# EAGLE design CCBee (EAGLE 5.11)
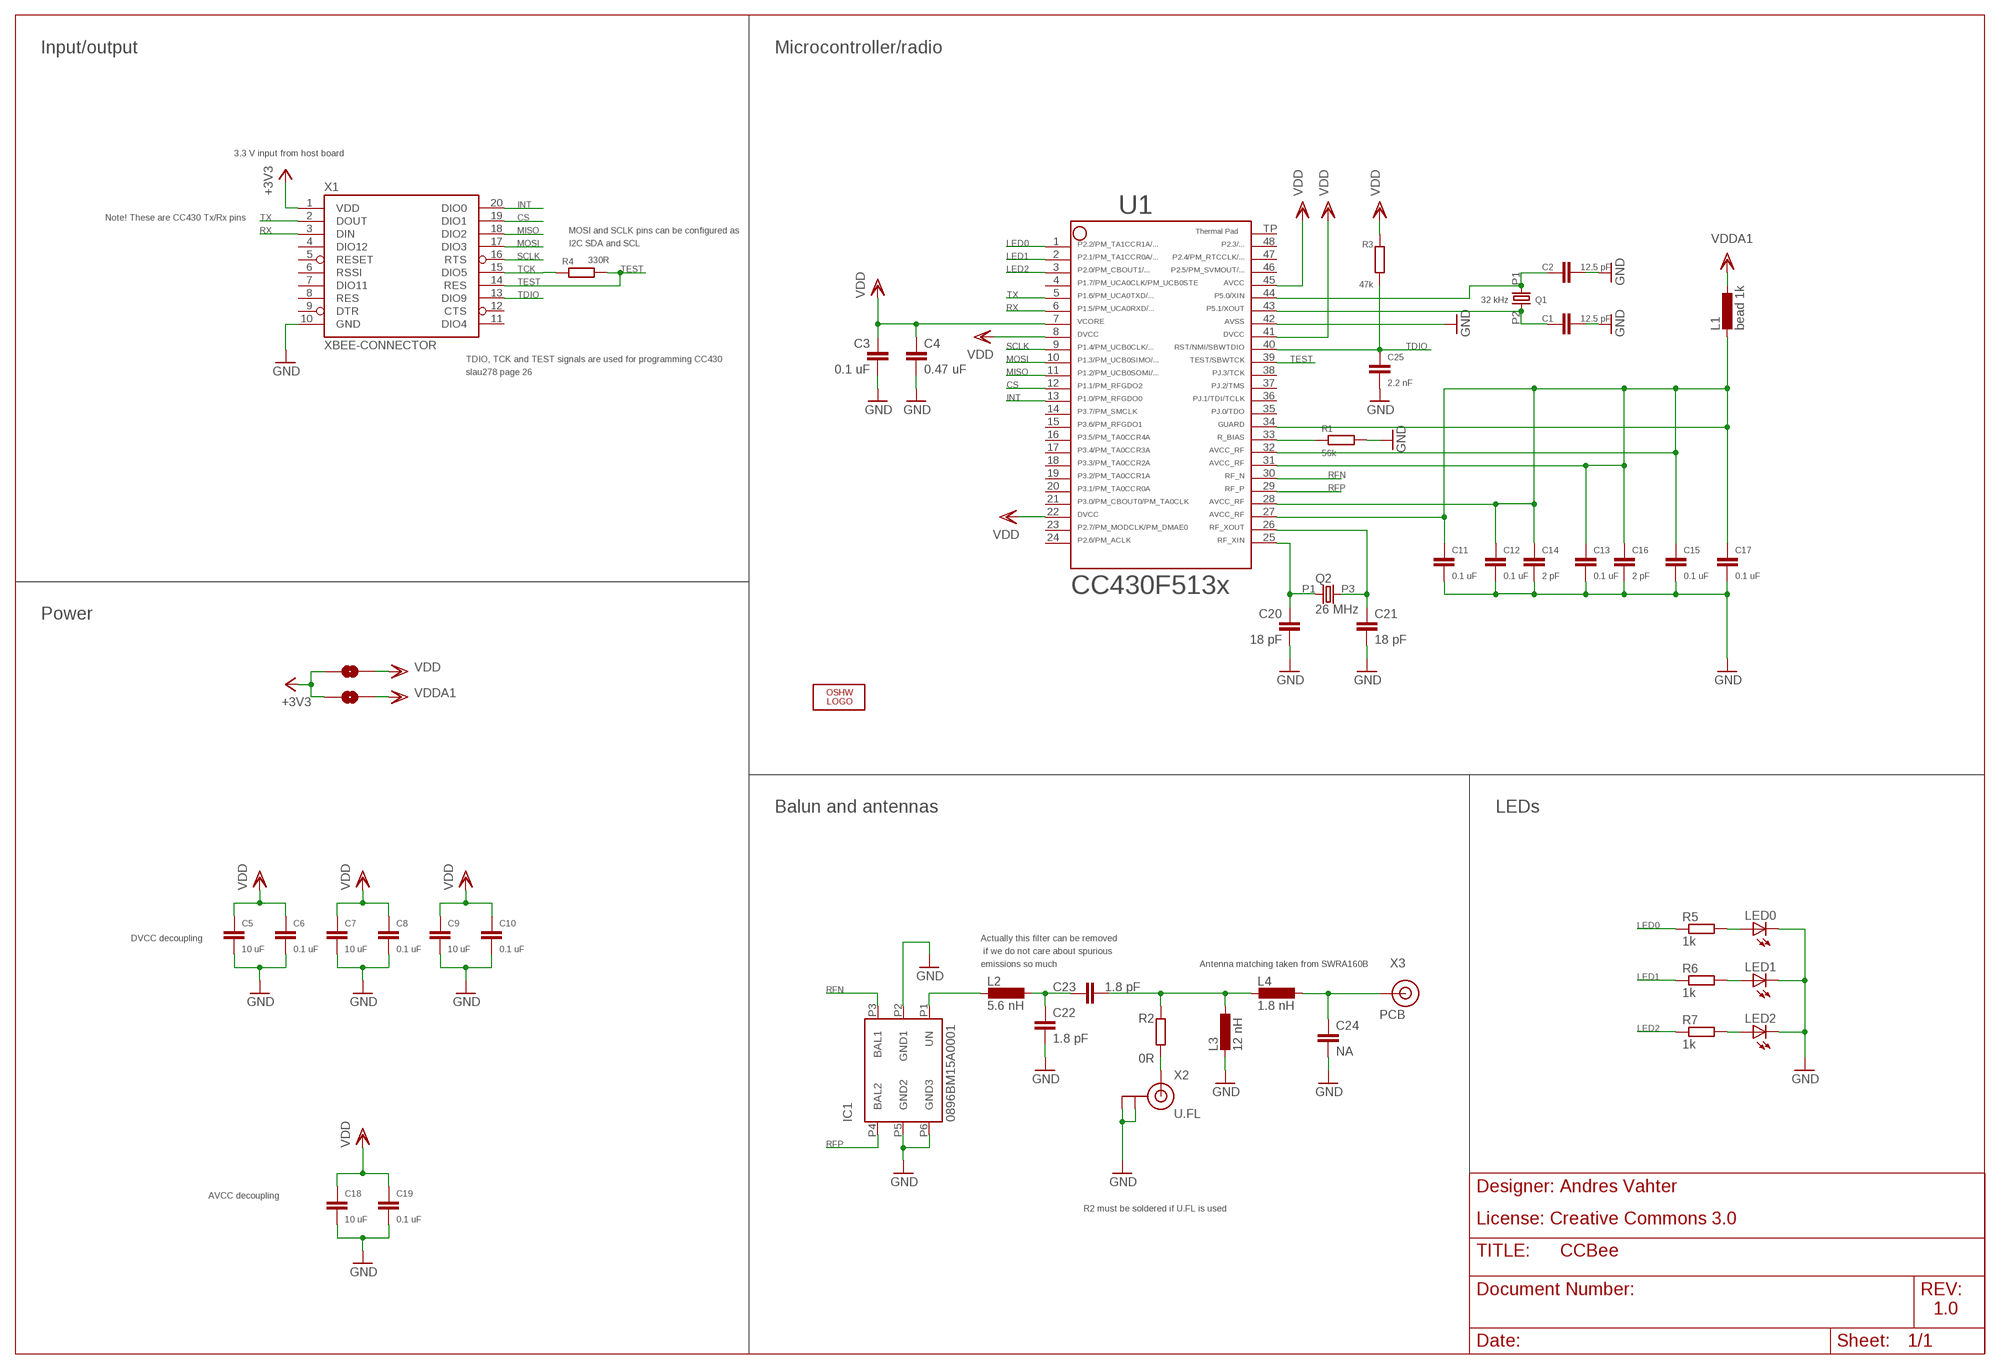
[diagram p0: schematic, sheet 1]

## Parts
C1  12.5 pF  C-EUC0402  [C0402]
C2  12.5 pF  C-EUC0402  [C0402]
C3  0.1 uF  C-EUC0402  [C0402]
C4  0.47 uF  C-EUC0603  [C0603]
C5  10 uF  C-EUC0603  [C0603]
C6  0.1 uF  C-EUC0402  [C0402]
C7  10 uF  C-EUC0603  [C0603]
C8  0.1 uF  C-EUC0402  [C0402]
C9  10 uF  C-EUC0603  [C0603]
C10  0.1 uF  C-EUC0402  [C0402]
C11  0.1 uF  C-EUC0402  [C0402]
C12  0.1 uF  C-EUC0402  [C0402]
C13  0.1 uF  C-EUC0402  [C0402]
C14  2 pF  C-EUC0402  [C0402]
C15  0.1 uF  C-EUC0402  [C0402]
C16  2 pF  C-EUC0402  [C0402]
C17  0.1 uF  C-EUC0402  [C0402]
C18  10 uF  C-EUC0603  [C0603]
C19  0.1 uF  C-EUC0402  [C0402]
C20  18 pF  C-EUC0402  [C0402]
C21  18 pF  C-EUC0402  [C0402]
C22  1.8 pF  C-EUC0402  [C0402]
C23  1.8 pF  C-EUC0402  [C0402]
C24  NA  C-EUC0402  [C0402]
C25  2.2 nF  C-EUC0603  [C0603]
IC1  0896BM15A0001  JOHANSON-BM  [JOHANSON-BM]
L1  bead 1k  L-EUL0603  [L0603]
L2  5.6 nH  L-EUL0402  [L0402]
L3  12 nH  L-EUL0402  [L0402]
L4  1.8 nH  L-EUL0402  [L0402]
LED0  LEDCHIP-LED0603  [CHIP-LED0603]
LED1  LEDCHIP-LED0603  [CHIP-LED0603]
LED2  LEDCHIP-LED0603  [CHIP-LED0603]
LOGO1  OSHW_LOGO_8MILX0200-NT  [OSHW_8X200_NOTEXT]
Q1  32 kHz  FC-13F  [FC-13F-3.2X1.5]
Q2  26 MHz  TXC  [TXC-5.0X3.2]
R1  56k  R-EU_R0402  [R0402]
R2  0R  R-EU_R0402  [R0402]
R3  47k  R-EU_R0402  [R0402]
R4  330R  R-EU_R0402  [R0402]
R5  1k  R-EU_R0402  [R0402]
R6  1k  R-EU_R0402  [R0402]
R7  1k  R-EU_R0402  [R0402]
SJ1  SOLDERJUMPERNC  [SJ_2S]
SJ2  SOLDERJUMPERNC  [SJ_2S]
U1  CC430F5137  CC430F513X---RGZ48  [RGZ48]
X1  XBEE-CONNECTOR  XBEE-1B1  [XBEE-1]
X2  U.FL  [U.FL]
X3  PCB  JOHANSON-0868AT43A0020  [JOHANSON-0868AT43A0020]

## Nets
+3V3: SJ1.1 SJ2.1 X1.1(VDD)
CS: U1.12 X1.19(DIO1)
GND: C1.2 C2.2 C3.2 C4.2 C5.2 C6.2 C7.2 C8.2 C9.2 C10.2 C11.2 C12.2 C13.2 C14.2 C15.2 C16.2 C17.2 C18.2 C19.2 C20.2 C21.2 C22.2 C24.2 C25.2 IC1.P2(GND1) IC1.P5(GND2) IC1.P6(GND3) L3.2 LED0.C LED1.C LED2.C R1.2 U1.42 X1.10(GND) X2.P$1(GND) X2.P$2(GND)
INT: U1.13 X1.20(DIO0)
LED0: R5.1 U1.1
LED1: R6.1 U1.2
LED2: R7.1 U1.3
MISO: U1.11 X1.18(DIO2)
MOSI: U1.10 X1.17(DIO3)
N$1: C1.1 Q1.P2 U1.43
N$2: C2.1 Q1.P1 U1.44
N$3: R1.1 U1.33
N$4: C22.1 C23.1 L2.1
N$5: C20.1 Q2.P1 U1.25
N$6: C21.1 Q2.P3 U1.26
N$7: C23.2 L3.1 L4.2 R2.2
N$8: R2.1 X2.P$3(SIGNAL)
N$9: IC1.P1(UN) L2.2
N$10: LED0.A R5.2
N$11: C24.1 L4.1 X3.P1
N$13: LED1.A R6.2
N$14: LED2.A R7.2
N$15: C11.1 C12.1 C13.1 C14.1 C15.1 C16.1 C17.1 L1.2 U1.27 U1.28 U1.31 U1.32 U1.34
RFN: IC1.P3(BAL1) U1.30
RFP: IC1.P4(BAL2) U1.29
RX: U1.6 X1.3(DIN)
SCLK: U1.9 X1.16(RTS)
TCK: R4.2 X1.15(DIO5)
TDIO: C25.1 R3.1 U1.40 X1.13(DIO9)
TEST: R4.1 U1.39 X1.14(RES)
TX: U1.5 X1.2(DOUT)
VDD: C3.1 C4.1 C5.1 C6.1 C7.1 C8.1 C9.1 C10.1 C18.1 C19.1 R3.2 SJ1.2 U1.7 U1.8 U1.22 U1.41 U1.45
VDDA1: L1.1 SJ2.2
Unconnected: Q2.P2(GND) Q2.P4(GND) U1.4 U1.14 U1.15 U1.16 U1.17 U1.18 U1.19 U1.20 U1.21 U1.23 U1.24 U1.35 U1.36 U1.37 U1.38 U1.46 U1.47 U1.48 X1.4(DIO12) X1.5(RESET) X1.6(RSSI) X1.7(DIO11) X1.8(RES) X1.9(DTR) X1.11(DIO4) X1.12(CTS) X3.NC1 X3.NC2 X3.NC3 X3.NC4 X3.NC5 X3.P2

## Notes on the sheet
- Input/output | Microcontroller/radio
- 3.3 V input from host board
- Note! These are CC430 Tx/Rx pins
- MOSI and SCLK pins can be configured as
- I2C SDA and SCL
- TDIO, TCK and TEST signals are used for programming CC430
- slau278 page 26
- Power
- Balun and antennas | LEDs
- DVCC decoupling | Actually this filter can be removed
- if we do not care about spurious
- emissions so much | Antenna matching taken from SWRA160B
- Designer: Andres Vahter
- AVCC decoupling
- R2 must be soldered if U.FL is used
- License: Creative Commons 3.0
- 1.0

## Power pins joined to a net without a drawn wire
49: U1.TP

## Library data of the parts
C1-C25 = rcl:C-EU: CAPACITOR, European symbol
IC1 = balun:JOHANSON-BM
L1-L4 = rcl:L-EU: INDUCTOR, European symbol
LED0 LED1 LED2 = led:LED: LED OSRAM: - CHIPLED LG R971, LG N971, LY N971, LG Q971, LY Q971, LO R971, LY R971 LH N974, LH R974 LS Q976, LO Q976, LY Q976 LO Q996 - Hyper CHIPLED LW Q18S LB Q993, LB Q99A, LB R99A - SideLED LS A670, LO A670, LY A670, LG A670, LP A670 LB A673, LV A673, LT A673, LW A673 LH A674 LY A675 LS A676, LA A676, LO A676, LY A676, LW A676 LS A679, LY A679, LG A679 - Hyper Micro SIDELED® LS Y876, LA Y876, LO Y876, LY Y876 LT Y87S - SmartLED LW L88C, LW L88S LB L89C, LB L89S, LG L890 LS L89K, LO L89K, LY L89K LS L896, LA L896, LO L896, LY L896 - TOPLED LS T670, LO T670, LY T670, LG T670, LP T670 LSG T670, LSP T670, LSY T670, LOP T670, LYG T670 LG T671, LOG T671, LSG T671 LB T673, LV T673, LT T673, LW T673 LH T674 LS T676, LA T676, LO T676, LY T676, LB T676, LH T676, LSB T676, LW T676 LB T67C, LV T67C, LT T67C, LS T67K, LO T67K, LY T67K, LW E67C LS E67B, LA E67B, LO E67B, LY E67B, LB E67C, LV E67C, LT E67C LW T67C LS T679, LY T679, LG T679 LS T770, LO T770, LY T770, LG T770, LP T770 LB T773, LV T773, LT T773, LW T773 LH T774 LS E675, LA E675, LY E675, LS T675 LS T776, LA T776, LO T776, LY T776, LB T776 LHGB T686 LT T68C, LB T68C - Hyper Mini TOPLED® LB M676 - Mini TOPLED Santana® LG M470 LS M47K, LO M47K, LY M47K Source: http://www.osram.convergy.de LUXEON: - LUMILED® LXK2-PW12-R00, LXK2-PW12-S00, LXK2-PW14-U00, LXK2-PW14-V00 LXK2-PM12-R00, LXK2-PM12-S00, LXK2-PM14-U00 LXK2-PE12-Q00, LXK2-PE12-R00, LXK2-PE12-S00, LXK2-PE14-T00, LXK2-PE14-U00 LXK2-PB12-K00, LXK2-PB12-L00, LXK2-PB12-M00, LXK2-PB14-N00, LXK2-PB14-P00, LXK2-PB14-Q00 LXK2-PR12-L00, LXK2-PR12-M00, LXK2-PR14-Q00, LXK2-PR14-R00 LXK2-PD12-Q00, LXK2-PD12-R00, LXK2-PD12-S00 LXK2-PH12-R00, LXK2-PH12-S00 LXK2-PL12-P00, LXK2-PL12-Q00, LXK2-PL12-R00 Source: www.luxeon.com KINGBRIGHT: KA-3528ASYC Source: www.kingbright.com
LOGO1 = OSHW:OSHW_LOGO_8MIL
Q1 = crystal:FC-13F: EPSON TOYOCOM - FC-13F,32.768KHZ, 12.5PF - CRYSTAL, 32.768KHZ, FC-13F, 12.5PF http://ee.farnell.com/epson-toyocom/fc-13f-32-768khz-12-5pf/crystal-32-768khz-fc-13f-12-5pf/dp/1712821
Q2 = crystal:TXC
R1-R7 = rcl:R-EU_: RESISTOR, European symbol
SJ1 SJ2 = solderjumper:SOLDERJUMPER: Solder Jumper Standard SMD solder jumper. Used to automate production. Two varients : Normally Open and Normally Closed are the same, but have different paste layers. NC will have a large amount of paste and should jumper during reflow.
U1 = TI_MSP430_v16:CC430F513X---RGZ48: ***CC430F513X***RGZ48 ** ** Rev 1.0 ** 06/2010 * http://focus.ti.com/docs/prod/folders/print/cc430f5137.html
X1 = xbee:XBEE-1
X2 = ufl:U.FL
X3 = antenna:JOHANSON-0868AT43A0020: 868MHz Antenna: Johanson Technology 0868AT43A0020 http://www.farnell.com/datasheets/1318292.pdf

## Board
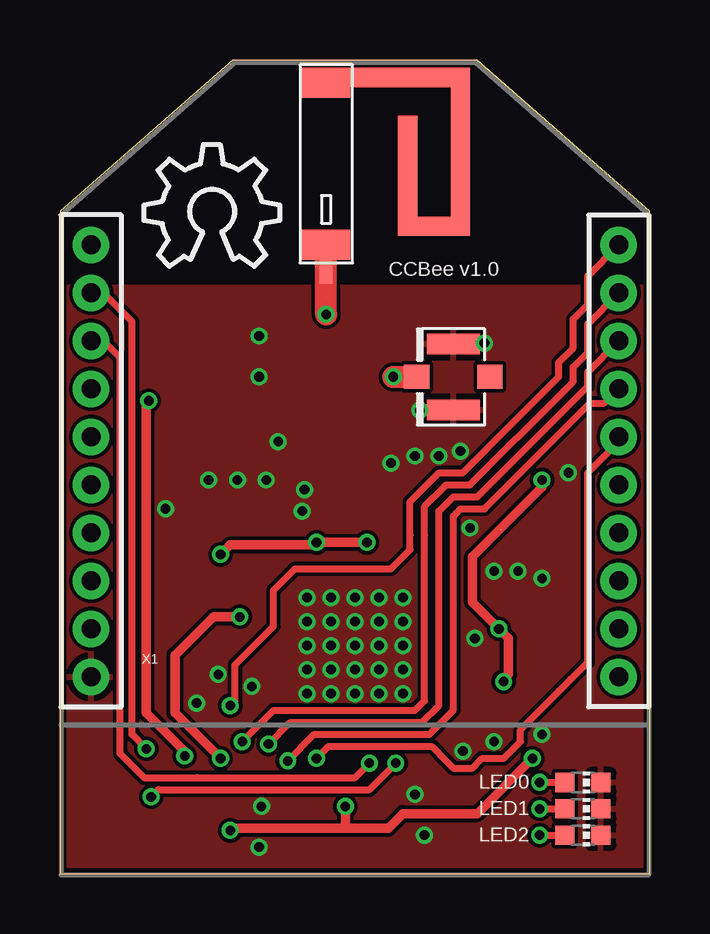
[diagram p1: board, top side]
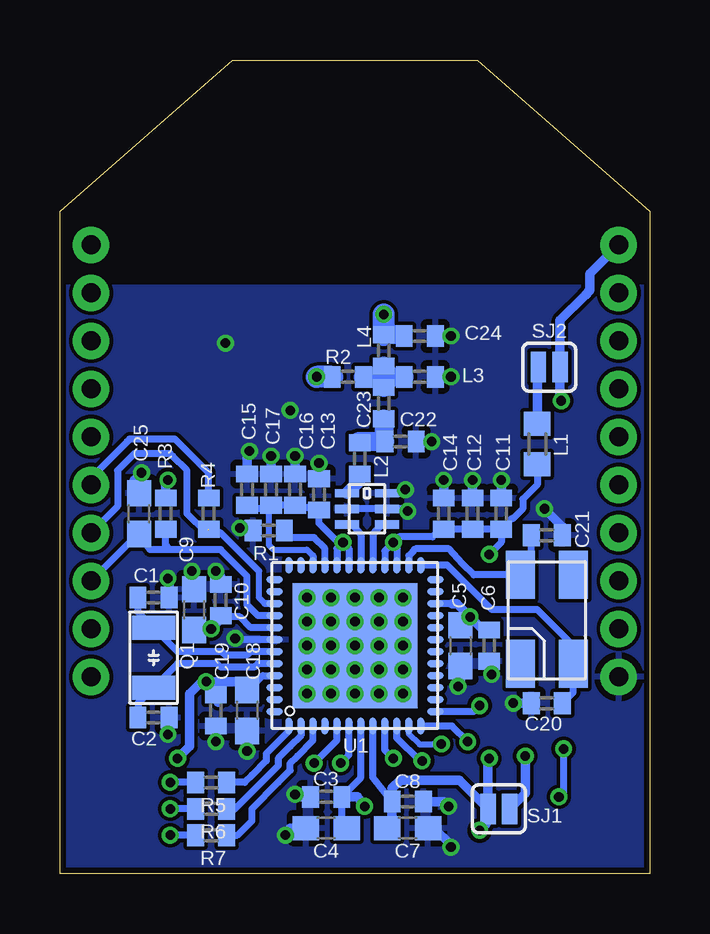
[diagram p2: board, bottom side, seen from below]

Size 24.6 x 33.9 mm. Coordinates in mm from the lower left corner, seen from the top.
Outline: 0,0 24.6,0 24.6,27.6 17.4,33.9 7.2,33.9 0,27.6 0,0
Copper layers (1*16): Top 0.035mm / dielectric 1.5mm / Bottom 0.035mm
Design rules "ITead_rule": minimum track width 6mil, minimum drill 12mil, track to track 6mil, track to pad 6mil, pad to pad 6mil, via to via 6mil, smd to smd 0mil, copper to edge 10mil, drill to drill 10mil, minimum pad ring 10mil, minimum via ring 6mil, stop-mask expansion 2mil, vias tented up to drill 100mil, thermal gap 10mil

### Footprints (pad centres in the part's own frame; a part is rotated, then mirrored left to right if it is on the bottom)
C0402 = smd 0.7 x 0.9: 1 -0.65,0; 2 0.65,0
C0603 = smd 1.1 x 1: 1 -0.85,0; 2 0.85,0
JOHANSON-BM = smd 0.35 x 1: P1 0.65,0.825; P2 0,0.825; P3 -0.65,0.825; P4 -0.65,-0.825; P5 0,-0.825; P6 0.65,-0.825
L0603 = smd 1 x 1.1: 1 -0.85,0; 2 0.85,0
L0402 = smd 0.7 x 0.9: 1 -0.65,0; 2 0.65,0
CHIP-LED0603 = smd 0.8 x 0.8: A 0,-0.75; C 0,0.75
FC-13F-3.2X1.5 = smd 1 x 1.8: P1 -1.25,0; P2 1.25,0
TXC-5.0X3.2 = smd 2 x 1.2: P1 -1.85,-1.1; P2 1.85,-1.1; P3 1.85,1.1; P4 -1.85,1.1
R0402 = smd 0.7 x 0.9: 1 -0.65,0; 2 0.65,0
SJ_2S = smd 0.635 x 1.27: 1 -0.45,0; 2 0.45,0
RGZ48 = smd 0.7 x 0.3: 1 -3.35,2.75; 2 -3.35,2.25; 3 -3.35,1.75; 4 -3.35,1.25; 5 -3.35,0.75; 6 -3.35,0.25; 7 -3.35,-0.25; 8 -3.35,-0.75; 9 -3.35,-1.25; 10 -3.35,-1.75; 11 -3.35,-2.25; 12 -3.35,-2.75; 25 3.35,-2.75; 26 3.35,-2.25; 27 3.35,-1.75; 28 3.35,-1.25; 29 3.35,-0.75; 30 3.35,-0.25; 31 3.35,0.25; 32 3.35,0.75; 33 3.35,1.25; 34 3.35,1.75; 35 3.35,2.25; 36 3.35,2.75 | smd 0.3 x 0.7: 13 -2.75,-3.35; 14 -2.25,-3.35; 15 -1.75,-3.35; 16 -1.25,-3.35; 17 -0.75,-3.35; 18 -0.25,-3.35; 19 0.25,-3.35; 20 0.75,-3.35; 21 1.25,-3.35; 22 1.75,-3.35; 23 2.25,-3.35; 24 2.75,-3.35; 37 2.75,3.35; 38 2.25,3.35; 39 1.75,3.35; 40 1.25,3.35; 41 0.75,3.35; 42 0.25,3.35; 43 -0.25,3.35; 44 -0.75,3.35; 45 -1.25,3.35; 46 -1.75,3.35; 47 -2.25,3.35; 48 -2.75,3.35 | smd 5.2 x 5.2: TP 0,0
XBEE-1 = drill 0.8 pad 1.524 round: 1 -11,20; 2 -11,18; 3 -11,16; 4 -11,14; 5 -11,12; 6 -11,10; 7 -11,8; 8 -11,6; 9 -11,4; 10 -11,2; 11 11,2; 12 11,4; 13 11,6; 14 11,8; 15 11,10; 16 11,12; 17 11,14; 18 11,16; 19 11,18; 20 11,20
U.FL = smd 2.2 x 0.85: P$1 0,1.375; P$2 0,-1.375 | smd 1.05 x 1: P$3 1.525,0; P$4 -1.525,0
JOHANSON-0868AT43A0020 = smd 0.8 x 5: NC1 6.975,-3.5 | smd 7 x 0.8: NC2 3.875,-5.6 | smd 0.8 x 3: NC3 0.775,-4.5 | smd 5 x 0.8: NC4 2.875,-3.4 | smd 1.025 x 0.5: NC5 -1.1,0 | smd 1.25 x 2: P1 0,0; P2 6.75,0

### Placement (x,y rotation side)
C1  20.7,11.5 0 bottom
C2  20.7,6.5 0 bottom
C3  13.5,3.2 180 bottom
C4  13.5,1.9 180 bottom
C5  7.9,9.5 270 bottom
C6  6.7,9.5 270 bottom
C7  10.1,1.9 0 bottom
C8  10.1,3 0 bottom
C9  19,11 90 bottom
C10  17.9,11.4 90 bottom
C11  6.2,15 90 bottom
C12  7.4,15 90 bottom
C13  13.8,15.8 90 bottom
C14  8.6,15 90 bottom
C15  16.8,16 90 bottom
C16  14.8,16 90 bottom
C17  15.8,16 90 bottom
C18  16.8,6.8 270 bottom
C19  18.1,6.8 270 bottom
C20  4.3,7.1 180 bottom
C21  4.3,14.1 0 bottom
C22  10.4,18 0 bottom
C23  11.1,19.6 90 bottom
C24  9.6,22.4 0 bottom
C25  21.3,15 90 bottom
IC1  11.8,15.2 90 bottom
L1  4.7,17.9 270 bottom
L2  12.1,17.3 270 bottom
L3  9.6,20.7 0 bottom
L4  11.1,21.8 270 bottom
LED0  21.8,3.8 270 top
LED1  21.8,2.7 270 top
LED2  21.8,1.6 270 top
LOGO1  3.5,25.3 0 top
Q1  20.7,9 90 bottom
Q2  4.3,10.6 90 bottom
R1  15.9,14.3 180 bottom
R2  12.6,20.7 0 bottom
R3  20.19,15 90 bottom
R4  18.4,15 90 bottom
R5  18.3,3.8 180 bottom
R6  18.3,2.7 180 bottom
R7  18.3,1.6 180 bottom
SJ1  6.3,2.7 180 bottom
SJ2  4.2,21.1 180 bottom
U1  12.3,9.5 90 bottom
X1  12.3,6.2 0 top
X2  16.4,20.7 180 top
X3  11.1,26.2 90 top

### Tracks (layer width: path | path; a pad name or v marks a point on that pad's centre or on a via)
+3V3  (via drill 0.4)
  Top 0.4: v3.7,19.7 3.6,19.6 3.6,19.5 3.6,19.2 3.6,6.7 5.2,5.1 v5.2,4.9
  Bottom 0.4: X1.1 2.5,25 2.5,24.3 2.7,24.1 3.75,23.05 SJ2.1 3.75,19.75 v3.7,19.7 | v5.2,4.9 5.2,3.35 SJ1.1
CS  (via drill 0.4)
  Top 0.3: v7.6,5.5 8.9,6.8 9.2,6.8 14.8,6.8 15.2,7.2 15.2,14.1 15.2,15.3 16,16.1 16.1,16.2 17.1,16.2 21,20.1 21.4,20.5 21.4,21.1 22,21.7 22,22.9 X1.19
  Bottom 0.3: U1.12 8.25,6.15 v7.6,5.5
GND  (via drill 0.4)
  Top 0.5: X2.P$1 15.22,19.32 v15,19.3 | X2.P$2 17.62,22.07 v17.7,22.1
  Bottom 0.3: R1.2 16.6,14.3 16.9,14.3 | C25.2 21.5,16 | C7.2 9,1.9 | U1.42 17.25,9.75 v17.3,9.8 | C21.2 3.65,14.45 | IC1.P6 10.35,15.85 v10.2,16 | v10.1,15.1 10.3,15.2 IC1.P5 IC1.P2
  Bottom 0.4: C14.2 v8.6,16.4 | C12.2 v7.4,16.4 | C11.2 v6.2,16.4 | C20.2 v5.7,7.1 | C6.2 6.7,8.4 v6.6,8.3 | C13.2 v13.8,17.1 | C16.2 v14.8,17.4 | C17.2 v15.8,17.4 | C15.2 16.8,17.5 v16.7,17.6 | C1.2 20.05,12.25 v20.1,12.3 | C2.2 20.05,5.75 v20.1,5.8 | 16.9,14.3 v17.1,14.4 | 21.5,16 21.5,16.4 v21.2,16.7 | C19.2 v18.1,5.5 | C18.2 v16.8,5.1 | C8.2 8.6,3 v8.4,2.8 | 9,1.9 8.3,1.2 v8.3,1.1 | C4.2 15,1.9 15.2,1.7 v15.2,1.6 | C3.2 14.7,3.2 v14.8,3.3 | C10.2 17.9,12.4 v18.1,12.6 | C9.2 19,12.5 v19.1,12.6 | C24.2 v8.3,22.4 | L3.2 v8.3,20.7 | C22.2 v9.1,18 | 3.65,14.45 v4.4,15.2 | C5.2 7.9,7.9 v8,7.8
  other vias: 12.3,9.5 11.3,9.5 10.3,9.5 12.3,10.5 12.3,11.5 13.3,9.5 14.3,9.5 12.3,8.5 12.3,7.5 11.3,10.5 11.3,11.5 10.3,10.5 10.3,11.5 13.3,10.5 13.3,11.5 14.3,10.5 14.3,11.5 11.3,8.5 11.3,7.5 10.3,8.5 10.3,7.5 13.3,8.5 14.3,8.5 13.3,7.5 14.3,7.5
  pour Top: 0,0 24.6,0 24.6,24.5 14.9,24.5 9.9,24.5 0,24.5
  pour Bottom: 0,0 24.6,0 24.6,24.5 14.9,24.5 7.7,24.5 0,24.5
INT  (via drill 0.4)
  Top 0.3: X1.20 22,24.9 22,23.7 21.4,23.1 21.4,21.9 20.8,21.3 20.8,20.7 20.7,20.6 19.1,19 16.8,16.7 16.6,16.7 15.8,16.7 14.6,15.5 14.6,14.1 14.6,13.5 13.8,12.7 9.8,12.7 8.9,11.8 8.9,10.3 7.4,8.8 7.3,8.7 7.3,7.2 v7.1,7
  Bottom 0.3: U1.13 7.35,6.75 v7.1,7
LED0
  Bottom 0.3: U1.1 15.05,5.95 15.5,5.5 16,5 16,4.7 16.6,4.1 16.9,3.8 R5.1
LED1
  Bottom 0.3: U1.2 14.55,5.75 15,5.3 15.5,4.8 15.5,4.5 16.3,3.7 17.3,2.7 R6.1
LED2
  Bottom 0.3: U1.3 14.05,5.55 14.7,4.9 15,4.6 15,4.3 15.5,3.8 16.6,2.7 16.6,2.2 17.2,1.6 R7.1
MISO  (via drill 0.4)
  Top 0.3: v8.7,5.4 9.6,6.3 15.1,6.3 15.8,7 15.8,15.1 16.4,15.7 17.4,15.7 22,20.3 22,20.9 X1.18
  Bottom 0.254: U1.11 10.06,5.83 9.61,5.38 9,5.4
  Bottom 0.3: 9,5.4 v8.7,5.4
MOSI  (via drill 0.4)
  Top 0.3: v9.5,4.7 10.6,5.8 15.4,5.8 16.4,6.8 16.4,14.2 16.4,14.9 16.5,15 16.7,15.2 17.3,15.2 17.7,15.2 22.1,19.6 22.7,19.6 X1.17
  Bottom 0.3: U1.10 10.55,5.65 9.6,4.7 v9.5,4.7
N$1
  Bottom 0.3: C1.1 21.35,10.9 Q1.P2 19.7,9.25 17.85,9.25 17.8,9.2 17.7,9.1 16.8,9.1 16.65,9.25 U1.43
N$2
  Bottom 0.3: C2.1 21.35,7.1 Q1.P1 19.7,8.75 18.05,8.75 18,8.7 17.9,8.6 16.5,8.6 16.35,8.75 U1.44
N$3
  Bottom 0.3: U1.33 13.55,13.25 13.55,13.55 14,14 15.05,14 R1.1
N$4
  Bottom 0.3: 12.15,18 L2.1
  Bottom 0.5: 11.1,18.05 C22.1
  Bottom 0.8: C22.1 12.15,18 | C23.1 11.1,18.05
N$5
  Bottom 0.3: U1.25 8.45,12.85 8.1,12.5 6.8,11.2 6.6,11 4.7,11 4.3,10.6 3.2,9.5 Q2.P1 3.2,7.55 C20.1
N$6
  Bottom 0.3: U1.26 10.05,13.25 9.9,13.4 9.78,13.53 8.38,13.53 7.8,12.9 7.35,12.45 Q2.P3 4.95,12.9 C21.1
N$7
  Bottom 0.7: C23.2 11.55,20.7
  Bottom 0.8: C23.2 L4.2 | L3.1 R2.2 11.55,20.7
N$8  (via drill 0.4)
  Top 0.91: v13.9,20.7 X2.P$3
  Bottom 0.91: R2.1 v13.9,20.7
N$9
  Bottom 0.5: L2.2 12.1,16.38 IC1.P1
N$10  (via drill 0.4)
  Top 0.3: v20,3.8 LED0.A
  Bottom 0.3: R5.2 v20,3.8
N$11  (via drill 0.4)
  Top 0.91: v11.1,23.3 X3.P1
  Bottom 0.5: C24.1 10.3,22.45
  Bottom 0.8: 10.3,22.45 L4.1
  Bottom 0.91: L4.1 v11.1,23.3
N$13  (via drill 0.4)
  Top 0.3: v20,2.7 LED1.A
  Bottom 0.3: R6.2 v20,2.7
N$14  (via drill 0.4)
  Top 0.3: v20,1.6 LED2.A
  Bottom 0.3: R7.2 v20,1.6
N$15  (via drill 0.4)
  Top 0.3: 10.6,13.7 v10.7,13.8
  Top 0.4: 10.6,13.7 7.1,13.7 v6.7,13.3 | v10.7,13.8 v12.8,13.8
  Bottom 0.254: 14.05,13.25 14.3,13.5 15.7,13.5 15.9,13.7 15.9,15.25
  Bottom 0.3: 14.05,13.25 U1.34 | C11.1 5.75,14.8 5.7,14.8 5.3,15.2 5.3,15.6 4.7,16.2 L1.2 | C11.1 6.2,13.8 v6.7,13.3 | C11.1 C12.1 C14.1 8.75,14.35 9.07,14.03 10.47,14.03 v10.7,13.8 | U1.27 10.55,13.65 v10.7,13.8 | U1.28 11.05,13.45 v10.7,13.8 | U1.31 12.55,13.55 v12.8,13.8 | U1.32 13.05,13.55 v12.8,13.8 | C15.1 16.8,15.3 16.7,15.2 15.95,15.2 C17.1 | v12.8,13.8 13,13.8 13.8,14.6 C13.1 C16.1 C17.1 | C17.1 15.9,15.25
RFN
  Bottom 0.3: U1.30 12.05,14.15 12.2,14.3 12.45,14.55 IC1.P3
RFP
  Bottom 0.3: U1.29 11.55,14.15 11.4,14.3 11.15,14.55 IC1.P4
RX  (via drill 0.4)
  Top 0.3: X1.3 1.8,22.2 2.5,21.5 2.5,5 3.5,4 5.7,4 12.3,4 v12.9,4.6
  Bottom 0.3: U1.6 12.55,4.95 v12.9,4.6
SCLK  (via drill 0.4)
  Top 0.3: v10.7,4.8 11.2,5.3 14.7,5.3 15.5,5.3 16.1,4.7 16.3,4.5 16.4,4.4 17.2,4.4 17.6,4.8 18.5,4.8 18.7,5 19,5.3 19.2,5.5 19.2,6 20.8,7.6 21.3,8.1 21.6,8.4 22,8.8 22,9 22,10.3 22,16.7 23.3,18 X1.16
  Bottom 0.3: U1.9 11.05,5.15 v10.7,4.8
TCK
  Bottom 0.3: X1.15 23.3,16.5 21.8,18 21.7,18.1 19.8,18.1 18.4,16.7 R4.2
TDIO
  Bottom 0.3: U1.40 16.35,10.75 16.8,11.2 16.8,12.4 17.9,13.5 20,13.5 | C25.1 21.55,14.2 | 20,13.5 20.85,13.5 C25.1 | R3.1 20.2,13.7 20,13.5 | C25.1 21.5,14 X1.13
TEST  (1 unrouted)
  Bottom 0.254: 16.05,11.25 16.2,11.4 16.3,11.5 16.3,12.6
  Bottom 0.3: U1.39 16.05,11.25 | 16.3,12.6 17.4,13.7 17.9,14.2 18.25,14.2 18.35,14.3 18.4,14.3 18.6,14.3 19.2,14.9 19.3,15 19.3,16.2 19.3,16.8 19.9,17.4 20,17.5 21.5,17.5 22.2,16.8 22.2,15.3 X1.14
TX  (via drill 0.4)
  Top 0.3: X1.2 1.8,24.2 2.9,23.1 3,23 3,7.1 3,5.8 v3.6,5.2 | v3.8,3.2 4.1,3.5 12.9,3.5 v14,4.6
  Bottom 0.3: U1.5 13.05,5.55 v14,4.6 | v3.6,5.2 3.6,3.4 v3.8,3.2
VDD  (via drill 0.4)
  Top 0.4: v7.5,10.7 6.4,10.7 4.8,9.1 4.8,6.7 v6.7,4.8 | v7.1,1.8 7.2,1.9 11.9,1.9 | 11.9,1.9 13.7,1.9 14.3,2.5 17.4,2.5 v19.7,4.8 | 11.9,1.9 v11.9,2.8 | v18.5,8 18.4,8 18.7,8.3 18.7,9.8 v18.3,10.2 17.2,11.3 17.2,13.2 20.1,16.1 v20.1,16.4
  Bottom 0.3: 8.25,11.25 U1.22 | 11,1.95 C7.1 10.75,2.1 | C4.1 12.85,2.1 C3.1 12.05,4 U1.7 | U1.41 16.65,10.25 17.1,10.7 17.85,10.7 C10.1 | U1.8 11.55,4 C8.1 10.95,3.2 | 18,7.15 C19.1 | U1.45 16.15,8.25 16.6,7.8 16.6,7.45 C18.1
  Bottom 0.4: 10.75,2.1 C8.1 10.75,3.55 10.4,3.9 7.95,3.9 SJ1.2 | 6.8,4.7 v6.7,4.8 6.75,4.75 SJ1.2 | 8.25,11.25 8.05,11.25 v7.5,10.7 | C6.1 6.95,10.15 v7.5,10.7 | SJ1.2 6.85,2.7 6.85,2.05 v7.1,1.8 | C3.1 12.2,3.2 v11.9,2.8 | v18.5,8 16.8,8 16.6,7.8 | 18,7.15 18,7.5 v18.5,8 | C9.1 18.95,10.2 v18.3,10.2 17.9,10.6 C10.1 | v18.5,8 18.7,8 19.2,7.5 19.2,5.3 v19.7,4.8 | R3.2 20.2,16.3 v20.1,16.4 | v7.5,10.7 7.55,10.7 C5.1
VDDA1
  Bottom 0.3: 4.7,21.05 SJ2.2
  Bottom 0.4: L1.1 4.7,21.05

### Text on the board
tPlace: CCBee v1.0